# Altium schematic sheet fsm.SchDoc
size 508 x 241 mm; PageSetup: Record=PageOptions|CenterHorizontal=True|CenterVertical=True|PrintScale=0.71|XCorrection=1.00|YCorrection=1.00|PrintKind=0|BorderSize=5000000|LeftOffset=0|BottomOffset=0|Orientation=2|PaperLength=1000|PaperWidth=1000|Scale=100|PaperSource=7|PrintQuality=-4|MediaType=1|DitherType=10|PaperKind=A4 (8.2 x 11.7 in; 210 x 297 mm)|PrintScaleMode=1
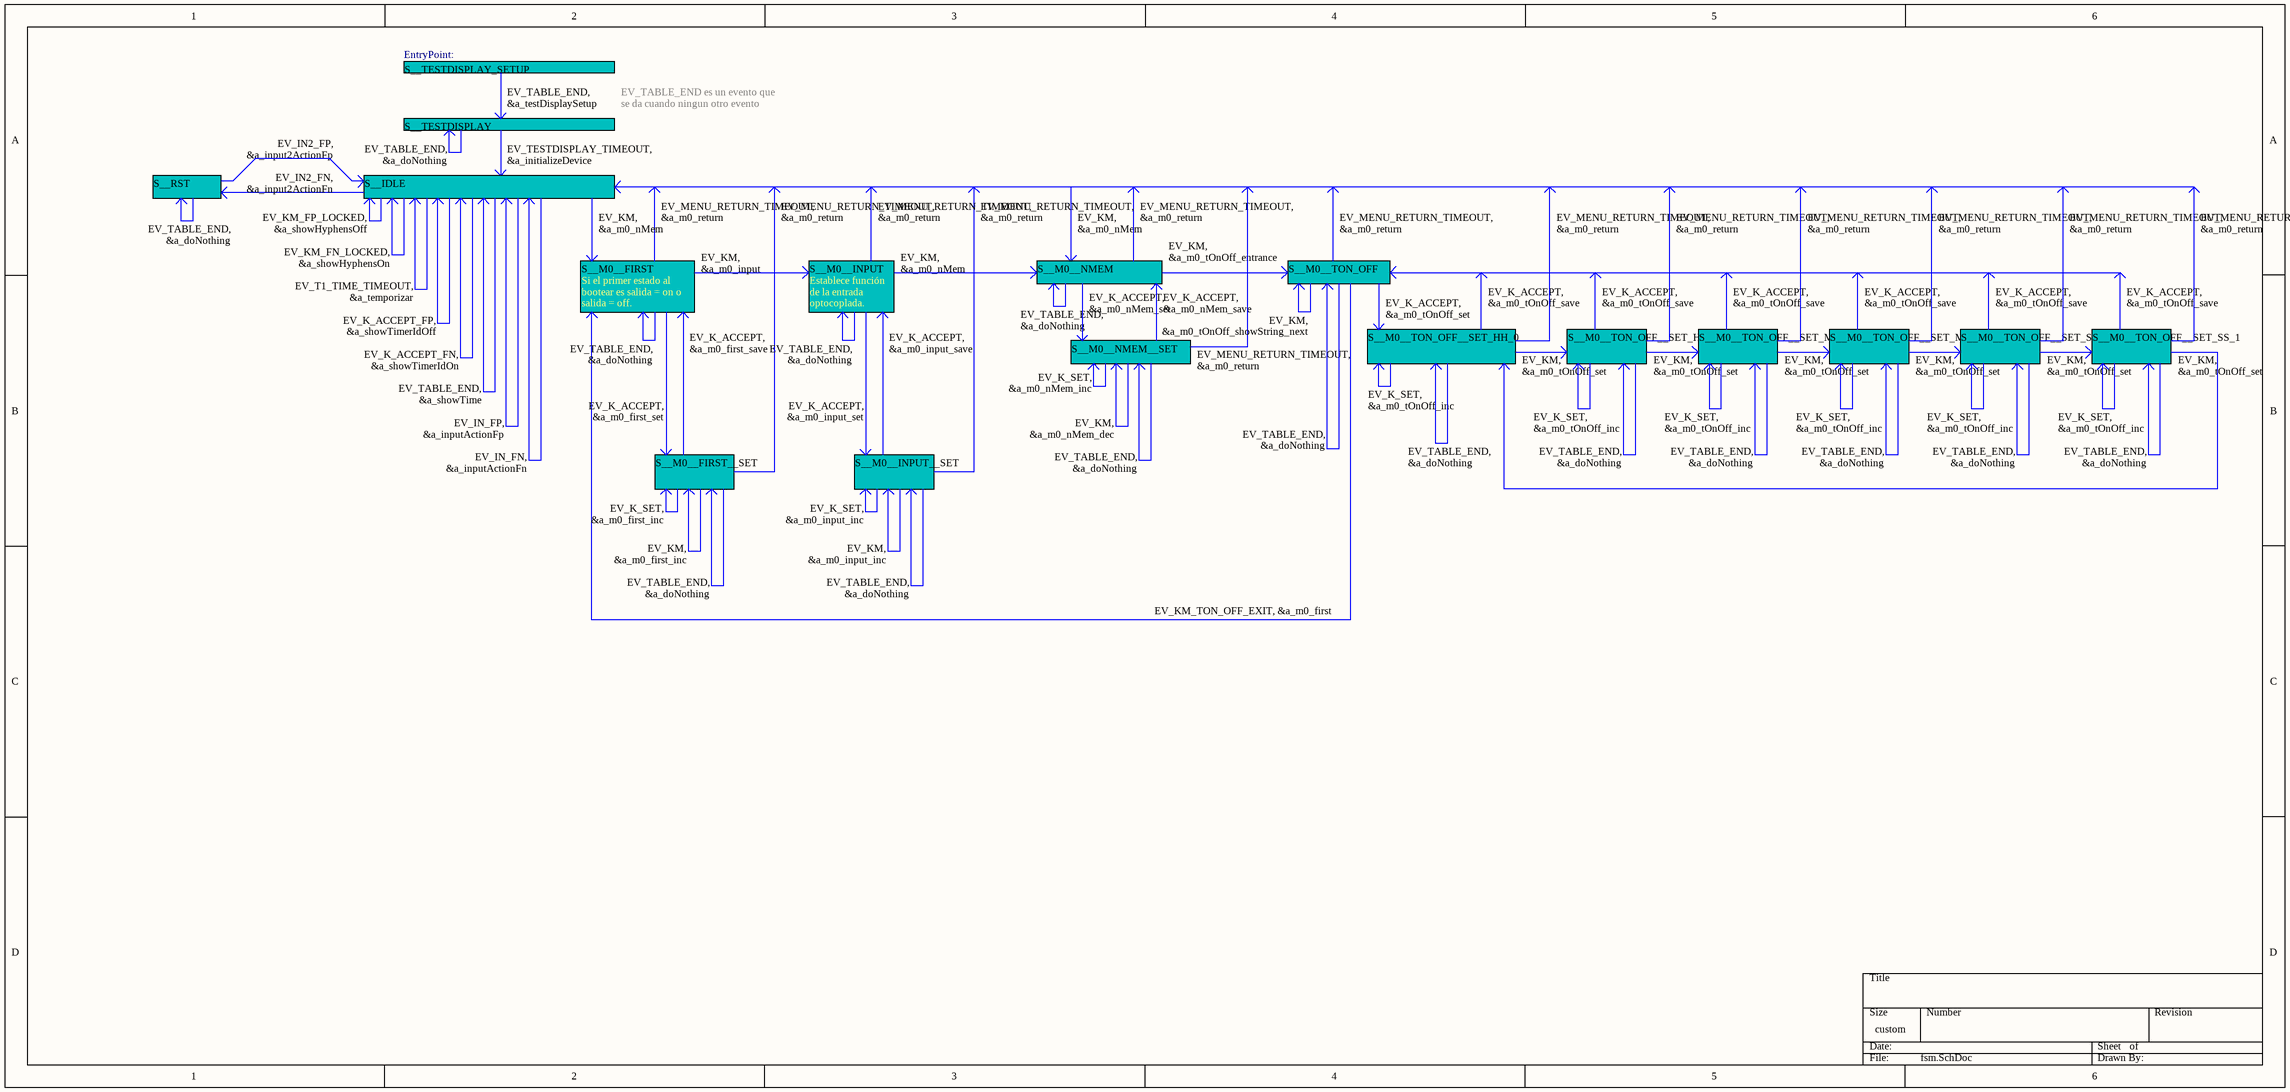
[diagram p0: fsm.SchDoc]

## Notes on the sheet
- S__TESTDISPLAY_SETUP
- EntryPoint:
- S__TESTDISPLAY
- EV_TABLE_END, &a_testDisplaySetup
- EV_TABLE_END es un evento que se da cuando ningun otro evento ocurre. Es como un "default".
- S__RST
- EV_IN2_FP, &a_input2ActionFp
- EV_IN2_FN, &a_input2ActionFn
- EV_TABLE_END, &a_doNothing
- S__IDLE
- EV_TESTDISPLAY_TIMEOUT, &a_initializeDevice
- EV_KM_FP_LOCKED, &a_showHyphensOff
- EV_KM, &a_m0_nMem
- EV_MENU_RETURN_TIMEOUT, &a_m0_return
- EV_KM_FN_LOCKED, &a_showHyphensOn
- EV_T1_TIME_TIMEOUT, &a_temporizar
- S__M0__FIRST
- Si el primer estado al bootear es salida = on o salida = off.
- EV_KM, &a_m0_input
- S__M0__INPUT
- Establece función de la entrada optocoplada.
- S__M0__NMEM
- EV_KM, &a_m0_tOnOff_entrance
- S__M0__TON_OFF
- EV_K_ACCEPT, &a_m0_tOnOff_set
- EV_K_ACCEPT_FP, &a_showTimerIdOff
- EV_K_ACCEPT_FN, &a_showTimerIdOn
- S__M0__NMEM__SET
- EV_K_ACCEPT, &a_m0_nMem_set
- EV_K_ACCEPT, &a_m0_nMem_save
- EV_KM, &a_m0_tOnOff_showString_next
- S__M0__TON_OFF__SET_HH_0
- EV_K_ACCEPT, &a_m0_tOnOff_save
- S__M0__TON_OFF__SET_HH_1
- S__M0__TON_OFF__SET_MM_0
- S__M0__TON_OFF__SET_MM_1
- S__M0__TON_OFF__SET_SS_0
- S__M0__TON_OFF__SET_SS_1
- EV_TABLE_END, &a_showTime
- EV_K_ACCEPT, &a_m0_first_save
- EV_K_ACCEPT, &a_m0_input_save
- EV_K_SET, &a_m0_nMem_inc
- EV_KM, &a_m0_tOnOff_set
- EV_K_SET, &a_m0_tOnOff_inc
- EV_IN_FP, &a_inputActionFp
- EV_IN_FN, &a_inputActionFn
- EV_K_ACCEPT, &a_m0_first_set
- EV_K_ACCEPT, &a_m0_input_set
- EV_KM, &a_m0_nMem_dec
- EV_K_SET, &a_m0_first_inc
- S__M0__FIRST__SET
- EV_K_SET, &a_m0_input_inc
- S__M0__INPUT__SET
- EV_KM, &a_m0_first_inc
- EV_KM, &a_m0_input_inc
- EV_KM_TON_OFF_EXIT, &a_m0_first